# Altium schematic sheet eCore_USB.SchDoc
size A
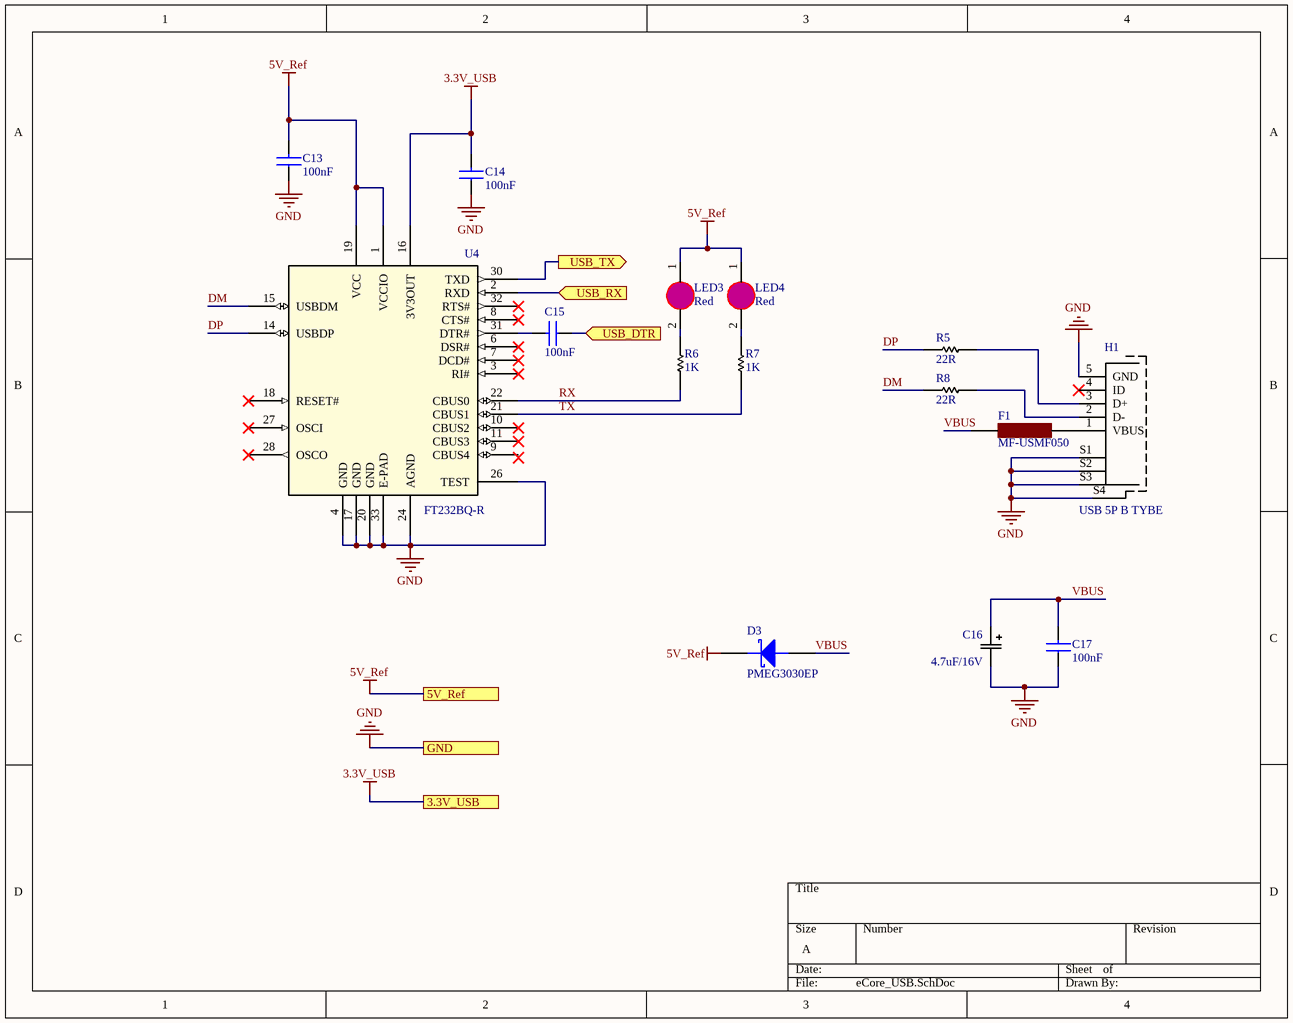
[diagram p0: eCore_USB.SchDoc]

## Parts
C13  100nF  [CAPC1005X60N]
C14  100nF  [CAPC1005X60N]
C15  100nF  [CAPC1005X60N]
C16  4.7uF/16V  [CAPCP3216X180N]
C17  100nF  [CAPC1005X60N]
D3  PMEG3030EP  [SOD128]
F1  MF-USMF050  [Fuse MF-USMF050]
H1  USB 5P B TYBE  [USB 5P B TYPE]
LED3  Red  [LEDR-0402]
LED4  Red  [LEDR-0402]
R5  22R  [RES 0402 SMD]
R6  1K  [RES 0402 SMD]
R7  1K  [RES 0402 SMD]
R8  22R  [RES 0402 SMD]
U4  FT232BQ-R  [QFN_FTDI5X5]

## Ports
3.3V_USB, 5V_Ref, GND, USB_DTR (in), USB_RX (in), USB_TX (out)

## Nets
3.3V_USB: C14.2 U4.16(3V3OUT) ; port 3.3V_USB
5V_Ref: C13.2 D3.K LED3.1(A) LED4.1(A) U4.1(VCCIO) U4.19(VCC) ; port 5V_Ref
GND: C13.1 C14.1 C16.2(C2) C17.1 H1.5 H1.S1 H1.S2 H1.S3 H1.S4 U4.4(GND) U4.17(GND) U4.20(GND) U4.24(AGND) U4.26(TEST) U4.33(E-PAD) ; port GND
DM: R8.1 U4.15(USBDM)
DP: R5.1 U4.14(USBDP)
RX: R6.1 U4.22(CBUS0)
TX: R7.1 U4.21(CBUS1)
USB_DTR: C15.1 ; port USB_DTR
USB_RX: U4.2(RXD) ; port USB_RX
USB_TX: U4.30(TXD) ; port USB_TX
VBUS: C16.1(C1) C17.2 D3.A F1.1
NetC15_2: C15.2 U4.31(DTR#)
NetF1_2: F1.2 H1.1(VBUS)
NetH1_2: H1.2(D-) R8.2
NetH1_3: H1.3(D+) R5.2
NetLED3_2: LED3.2(K) R6.2
NetLED4_2: LED4.2(K) R7.2

Not connected (* = marked no-connect by the designer): H1 4(ID)* 6; U4 3(RI#)* 5(NC) 6(DSR#)* 7(DCD#)* 8(CTS#)* 9(CBUS4) 10(CBUS2)* 11(CBUS3)* 12(NC) 13(NC) 18(RESET#)* 23(NC) 25(NC) 27(OSCI)* 28(OSCO)* 29(NC) 32(RTS#)*

## Library data of the parts
C13-C15 C17 = Cap 0402
C16 = CAP Tantalum Case A: Cap Tant Solid 4.7uF 16V A CASE 10% (3.2 X 1.6 X 1.6mm) SMD 3216-18 2.9 Ohm 175C Automotive T/R; MP: THJA475K016RJN; MF: AVX; Availability: Good; Price: 0.27 USD; Package: 1206 AVX; Value: *
H1 = USB 5P B TYBE: USB conector
LED3 LED4 = LEDSMD: LED 3mm
R5-R8 = Res 0402: Resistor; Manufacturer: Generic Components; Class: Passive; Published: 08/06/2000; Publisher: Altium Hobart Technology Centre; SubClass: Resistor
U4 = FT232BQ-R: Imported; Manufacturer_Part_Number: FT232BQ-REEL; Vendor: FTDI, Future Technology Devices International Ltd; Built_By: EMA_UL_Team; C: Copyright (C) 2016 Accelerated Designs. All rights reserved; Value: Value; Type: Type; RefDes: RefDes